# Altium schematic sheet Main MCU.SchDoc
size A3
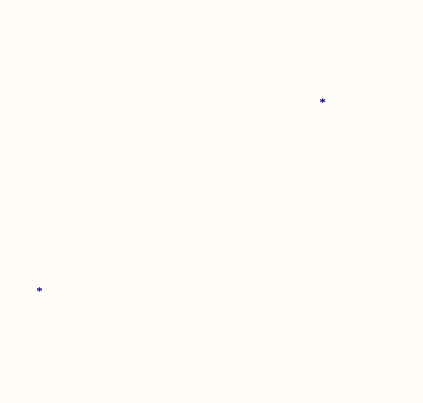
[diagram p0: Main MCU.SchDoc, left]
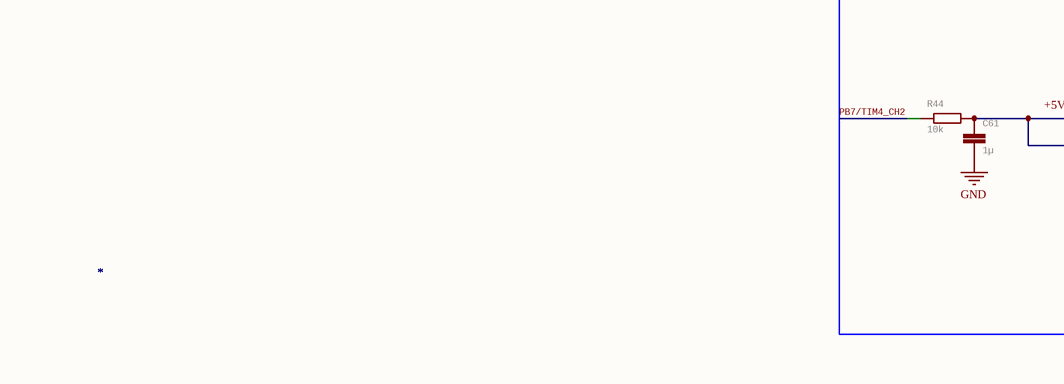
[diagram p1: Main MCU.SchDoc, middle]
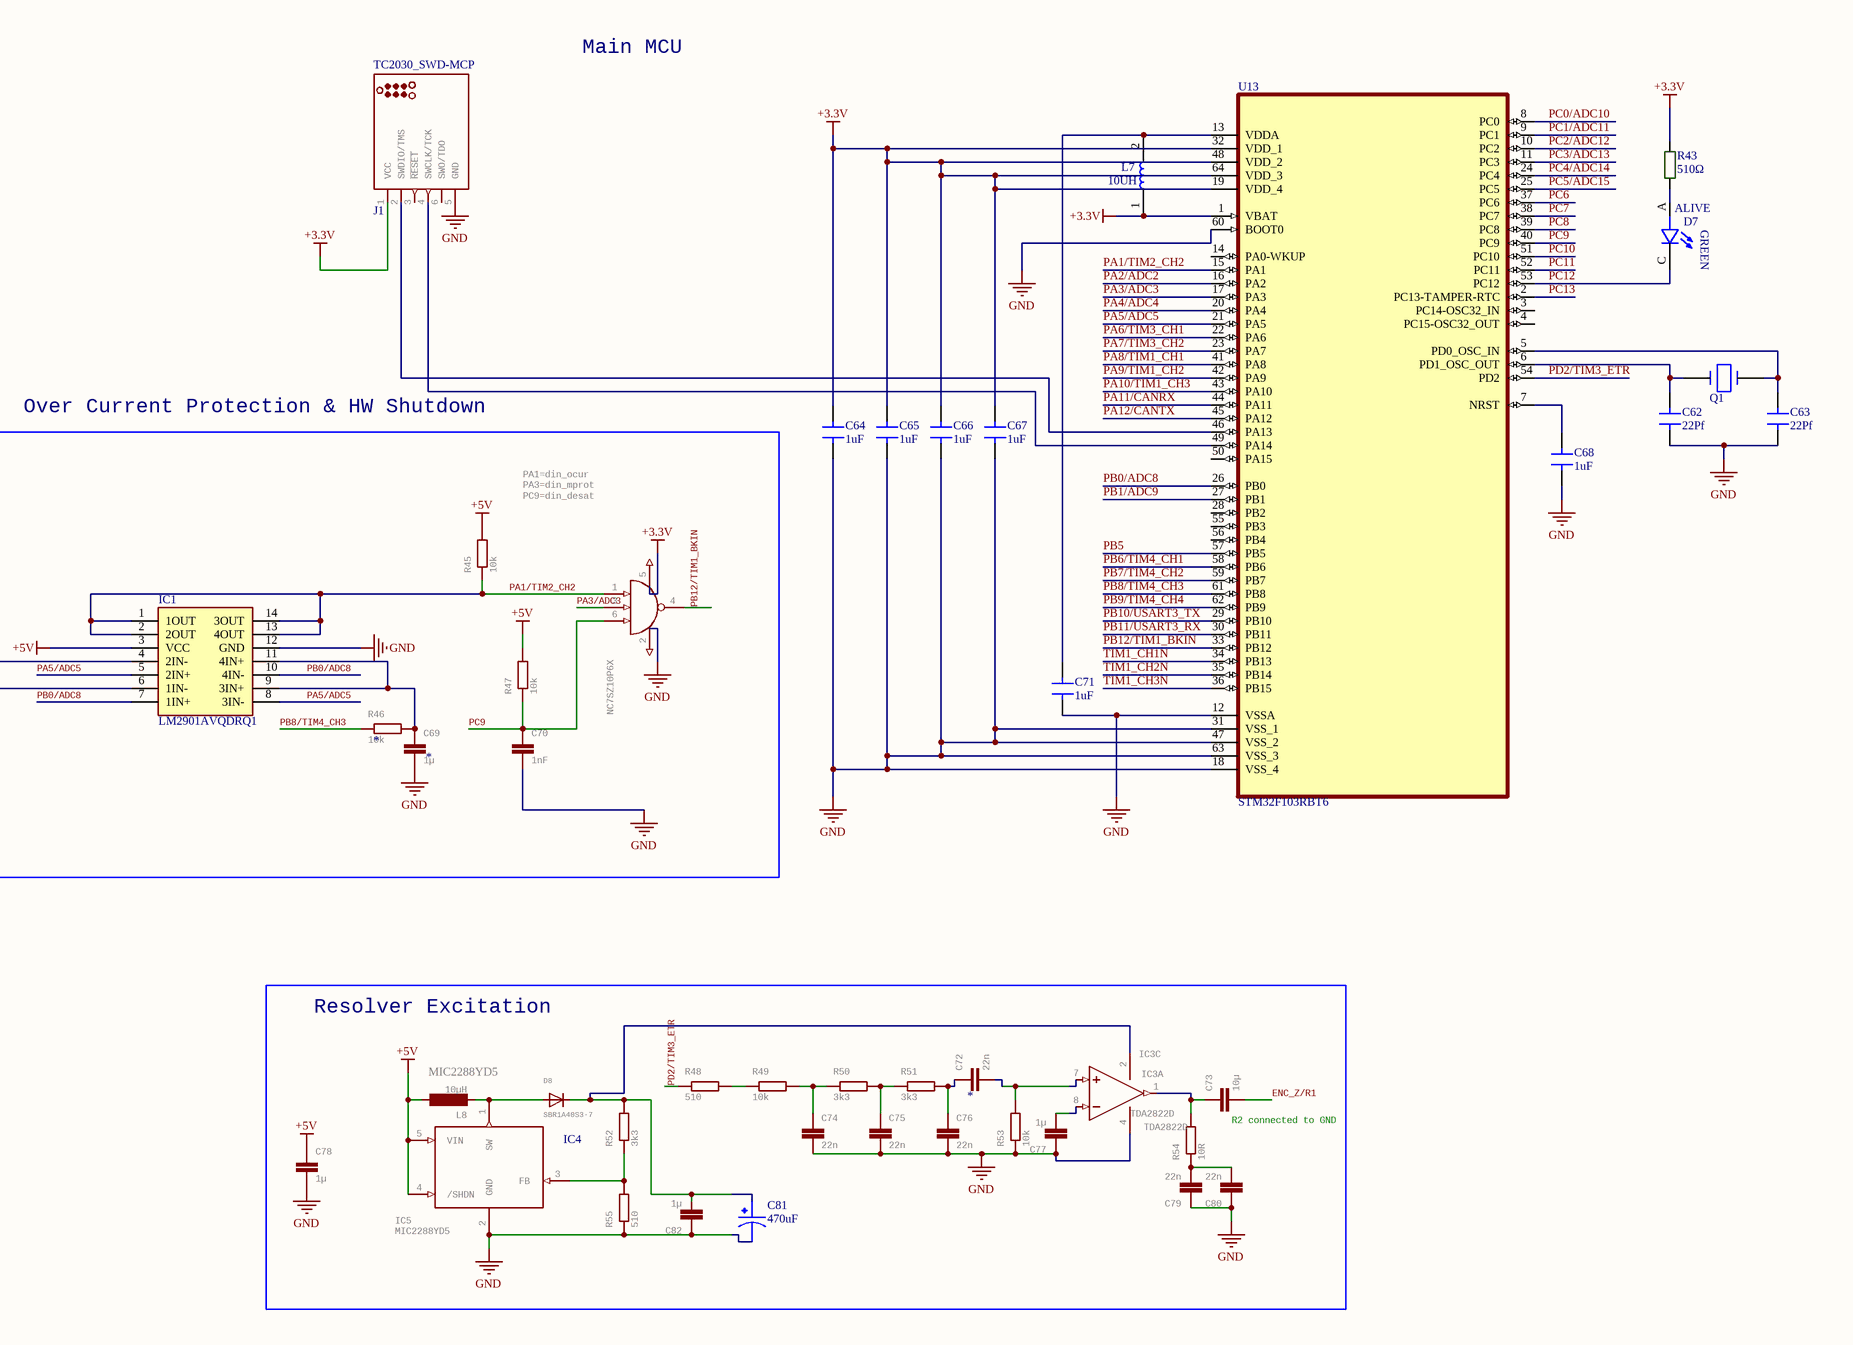
[diagram p2: Main MCU.SchDoc, right]

## Parts
C61  *  value 1µ  [C-0603W]
C62  22Pf  [C-0603W]
C63  22Pf  [C-0603W]
C64  1uF  [C-0603W]
C65  1uF  [C-0603W]
C66  1uF  [C-0603W]
C67  1uF  [C-0603W]
C68  1uF  [C-0603W]
C69  *  value 1µ  [C-0603W]
C70  *  value 1nF  [C-0603W]
C71  1uF  [C-0603W]
C72  *  value 22n  [C-0603W]
C73  *  value 10µ  [C-0805]
C74  *  value 22n  [C-0603W]
C75  *  value 22n  [C-0603W]
C76  *  value 22n  [C-0603W]
C77  *  value 1µ  [C-0603W]
C78  *  value 1µ  [C-0603W]
C79  *  value 22n  [C-0603W]
C80  *  value 22n  [C-0603W]
C81  470uF  [CapSmdElc]
C82  *  value 1µ  [C-0603W]
D7  ALIVE  [LED_7012X1]
D8  *  value SBR1A40S3-7  [SOD-323F]
IC1  LM2901AVQDRQ1  [SOIC127P600X175-14N]
IC3  TDA2822D  [SO08]  (parts A,C of 3)
IC4  MIC2288YD5  [SOT23-5L]
IC?  NC7SZ10P6X  [SC70-6]  (part A of 2)
J1  TC2030_SWD-MCP  [TC2030-MCP]
L7  10UH  [INDC2012X87N]
L8  *  value 10µH  [L2825P]
Q1  Crystal 8MHz  [5032-2P]  (value not drawn)
R43  510Ω  [R-0603R]
R44  *  value 10k  [R-0603R]
R45  *  value 10k  [R-0603R]
R46  *  value 10k  [R-0603R]
R47  *  value 10k  [R-0603R]
R48  *  value 510  [R-0603R]
R49  *  value 10k  [R-0603R]
R50  *  value 3k3  [R-0603R]
R51  *  value 3k3  [R-0603R]
R52  *  value 3k3  [R-0603R]
R53  *  value 10k  [R-0603R]
R54  *  value 10R  [R-0603R]
R55  *  value 510  [R-0603R]
U13  STM32F103RBT6  [QFP50P1200X1200X160-64N]

## Blocks framed on the sheet
Resolver Excitation: C72-C82 D8 IC3 IC4 L8 R48-R55

## Nets
+3.3V: C64.2 C65.2 C66.2 C67.2 IC?.5(I0) J1.1(VCC) L7.1 R43.2 U13.1(VBAT) U13.19(VDD_4) U13.32(VDD_1) U13.48(VDD_2) U13.64(VDD_3)
+5V: C78.1 IC1.3(VCC) IC4.4(/SHDN) IC4.5(VIN) L8.1 R45.2 R47.2
GND: C61.2 C62.1 C63.1 C64.1 C65.1 C66.1 C67.1 C68.1 C69.2 C70.2 C71.1 C74.2 C75.2 C76.2 C77.1 C78.2 C79.1 C80.1 C81.2 C82.1 IC1.12(GND) IC3.4(V-) IC4.2(GND) IC?.2(I0) J1.5(GND) R53.1 R55.1 U13.12(VSSA) U13.18(VSS_4) U13.31(VSS_1) U13.47(VSS_2) U13.60(BOOT0) U13.63(VSS_3)
ENC_Z/R1: C73.2
PA1/TIM2_CH2: IC1.1(1OUT) IC1.2(2OUT) IC1.13(4OUT) IC1.14(3OUT) IC?.1(I0) R45.1 U13.15(PA1)
PA2/ADC2: U13.16(PA2)
PA3/ADC3: IC?.3(I1) U13.17(PA3)
PA4/ADC4: U13.20(PA4)
PA5/ADC5: IC1.5(2IN+) IC1.8(3IN-) U13.21(PA5)
PA6/TIM3_CH1: U13.22(PA6)
PA7/TIM3_CH2: U13.23(PA7)
PA8/TIM1_CH1: U13.41(PA8)
PA9/TIM1_CH2: U13.42(PA9)
PA10/TIM1_CH3: U13.43(PA10)
PA11/CANRX: U13.44(PA11)
PA12/CANTX: U13.45(PA12)
PB0/ADC8: IC1.7(1IN+) IC1.10(4IN-) U13.26(PB0)
PB1/ADC9: U13.27(PB1)
PB5: U13.57(PB5)
PB6/TIM4_CH1: U13.58(PB6)
PB7/TIM4_CH2: R44.1 U13.59(PB7)
PB8/TIM4_CH3: R46.1 U13.61(PB8)
PB9/TIM4_CH4: U13.62(PB9)
PB10/USART3_TX: U13.29(PB10)
PB11/USART3_RX: U13.30(PB11)
PB12/TIM1_BKIN: IC?.4(O) U13.33(PB12)
PC0/ADC10: U13.8(PC0)
PC1/ADC11: U13.9(PC1)
PC2/ADC12: U13.10(PC2)
PC3/ADC13: U13.11(PC3)
PC4/ADC14: U13.24(PC4)
PC5/ADC15: U13.25(PC5)
PC6: U13.37(PC6)
PC7: U13.38(PC7)
PC8: U13.39(PC8)
PC9: C70.1 IC?.6(I2) R47.1 U13.40(PC9)
PC10: U13.51(PC10)
PC11: U13.52(PC11)
PC12: D7.C U13.53(PC12)
PC13: U13.2(PC13-TAMPER-RTC)
PD2/TIM3_ETR: R48.1 U13.54(PD2)
TIM1_CH1N: U13.34(PB13)
TIM1_CH2N: U13.35(PB14)
TIM1_CH3N: U13.36(PB15)
NetC61_1: C61.1 IC1.4(2IN-) IC1.6(1IN-) R44.2
NetC62_2: C62.2 Q1.1 U13.6(PD1_OSC_OUT)
NetC63_2: C63.2 Q1.2 U13.5(PD0_OSC_IN)
NetC68_2: C68.2 U13.7(NRST)
NetC69_1: C69.1 IC1.9(3IN+) IC1.11(4IN+) R46.2
NetC71_2: C71.2 L7.2 U13.13(VDDA)
NetC72_1: C72.1 C76.1 R51.2
NetC72_2: C72.2 IC3.7(+IN) R53.2
NetC73_1: C73.1 IC3.1(OUT) R54.2
NetC74_1: C74.1 R49.2 R50.1
NetC75_1: C75.1 R50.2 R51.1
NetC77_2: C77.2 IC3.8(-IN)
NetC79_2: C79.2 C80.2 R54.1
NetC81_1: C81.1 C82.2 D8.C IC3.2(V+) R52.2
NetD7_A: D7.A R43.1
NetD8_A: D8.A IC4.1(SW) L8.2
NetIC4_3: IC4.3(FB) R52.1 R55.2
NetJ1_2: J1.2(SWDIO/TMS) U13.46(PA13)
NetJ1_4: J1.4(SWCLK/TCK) U13.49(PA14)
NetR48_2: R48.2 R49.1

Not connected (* = marked no-connect by the designer): J1 3(~{RESET}) 6(SWO/TDO); U13 3(PC14-OSC32_IN) 4(PC15-OSC32_OUT) 14(PA0-WKUP) 28(PB2) 50(PA15) 55(PB3) 56(PB4)

## Notes on the sheet
- Main MCU
- Over Current Protection & HW Shutdown
- PA1=din_ocur
  PA3=din_mprot
  PC9=din_desat
- (near C73) R2 connected to GND
- (near IC4) IC5
  MIC2288YD5
- (in symbol ALIVE) GREEN

## Library data of the parts
C61 C69 C70 C72 C74-C80 C82 = C-EUC0603: CAPACITOR, European symbol; GateName_1: G$1; SymbolName_1: C-EU; DeviceName: C0603; LibraryName: rcl; DeviceSetName: C-EU
C62-C68 C71 = C-0603
C73 = C-EUC0805: CAPACITOR, European symbol; GateName_1: G$1; SymbolName_1: C-EU; DeviceName: C0805; LibraryName: rcl; DeviceSetName: C-EU
C81 = 100 uF Electr Cap
D7 = ALIVE: Green LED Indication - Discrete 1.7V 0805 (2012 Metric); MP: 7012X1; Package: None; Price: None; Value: *; Availability: Unavailable
D8 = DIODESOD-323F: Diode   SMADIODE - SMA Surface Mount Package  20V 1A Schottky Diode Digikey: 641-1014-6-ND    DO-1N4148 - Through Hole Small Current Diode SOD-123 20V 1 A (.5mV Vf) Schottky Diode - Digikey: MBRX120TPMSCT-ND    SOD-323 10V 570mA (.38mV Vf, 3ns) Schottky Diode - Digikey: ZLLS410CT-ND    SOD-523 30V 30mA Schottky Diode (RB751S-40TE61) - Digikey: RB751S-40TE61CT-ND    SOT23-R/W - SOT23 Package (R = Solder Paste/Reflow Ovens, W = Hand-Soldering)  BAT54Film 40V 300mA - Digikey: 497-7162-1-ND; GateName_1: G$1; SymbolName_1: DIODE; DeviceName: SOD-323F; LibraryName: adafruit; DeviceSetName: DIODE
IC1 = LM2901AVQDRQ1: Integrated Circuit; Manufacturer_Name: Texas Instruments; Datasheet Link: http://www.ti.com/lit/gpn/lm2901av-q1; Height: 1.75mm; Manufacturer_Part_Number: LM2901AVQDRQ1; Mouser Part Number: 595-LM2901AVQDRQ1; Mouser Price/Stock: https://www.mouser.co.uk/ProductDetail/Texas-Instruments/LM2901AVQDRQ1?qs=pAO1Z172M84zSPVjiTRtmQ%3D%3D; Arrow Part Number: LM2901AVQDRQ1; Arrow Price/Stock: https://www.arrow.com/en/products/lm2901avqdrq1/texas-instruments
IC3 = TDA2822D: OP AMP; GateName_1: A; SymbolName_1: OPAMP; GateName_2: B; GateName_3: P; SymbolName_3: PWR+-; DeviceName: D; SymbolName_2: OPAMP; LibraryName: st-microelectronics; DeviceSetName: TDA2822
IC4 = MIC2288YD5: GateName_1: G$1; DeviceName: YD5; SymbolName_1: MIC2288; LibraryName: adafruit; DeviceSetName: MIC2288
IC? = 74*1G10X: 3-input NAND gate; GateName_1: >NAME; SymbolName_1: 7412; GateName_2: PWR; SymbolName_2: PWRN-1; DeviceName: X; LibraryName: 74xx-eu; DeviceSetName: 74*1G10
J1 = TC2030_SWD-MCP: ARM20-CTX 20-Pin to TC2030-IDC Adapter for Cortex           6-Pin (TC2030-IDC family)  Cortex SWD  Adapters                  The Tag-Connect ARM20-CTX adapter board allows our TC2030-IDC cables to be used for ARM SWD (Single Wire Debug) applications. Although intended for use with our patented TC2030-IDC (and TC2030-IDC-NL) Plug-of-Nailsâ„¢ Cables, the adapter may be useful to people wishing to use 6-pin 0.1â€ ribbon headers on their PCB instead of the traditional 20-Pin header.   Please note the TC2030-IDC or TC2030-IDC-NL cable is purchased separately, the cables and Segger JLINK seen in the pictures are not included!   Download the Datasheet here.; GateName_1: G$1; DeviceName: -MCP; SymbolName_1: SWD; LibraryName: tag-connect; DeviceSetName: TC2030_SWD
L7 = MLZ2012M100HTD25: FIXED IND 10UH 300MA 884 MOHM; Package: None; Price: None; Value: *; MP: MLZ2012M100HTD25; Availability: Unavailable
L8 = L-EUL2825P: INDUCTOR, European symbol; GateName_1: G$1; SymbolName_1: L-EU; DeviceName: L2825P; LibraryName: rcl; DeviceSetName: L-EU
Q1 = Crystal 8MHz: 32MHz Â±30ppm Crystal 18pF 40 Ohms HC-49/US; MF: Abracon; MP: ABLS2-32.000MHZ-D4YF-T; SnapEDA_Link: https://www.snapeda.com/parts/ABLS2-32.000MHZ-D4YF-T/Abracon%20LLC/view-part/333468/?ref=snap; Digi-Key_Part_Number: 535-9888-1-ND; Mouser-Purchase-URL: https://snapeda.com/shop?store=Mouser&id=333468; Value: *; Package: HC49/US Abracon; DigiKey-Purchase-URL: https://snapeda.com/shop?store=DigiKey&id=333468; Check_prices: https://www.snapeda.com/parts/ABLS2-32.000MHZ-D4YF-T/Abracon%20LLC/view-part/333468/?ref=eda
R43 = R-0603
R44-R55 = R-EU_R0603: RESISTOR, European symbol; GateName_1: G$1; SymbolName_1: R-EU; DeviceName: R0603; DeviceSetName: R-EU_; LibraryName: rcl
U13 = STM32F103RBT6: ARMÂ® CortexÂ®-M3 STM32F1 Microcontroller IC 32-Bit 72MHz 128KB _128K x 8_ FLASH; MF: STMicroelectronics; Value: *; MP: STM32F103RBT6; Package: LQFP-64 STMicroelectronics; Price: None; SnapEDA_Link: https://www.snapeda.com/parts/STM32F103RBT6/STMicroelectronics/view-part/558286/?ref=snap; Availability: Unavailable